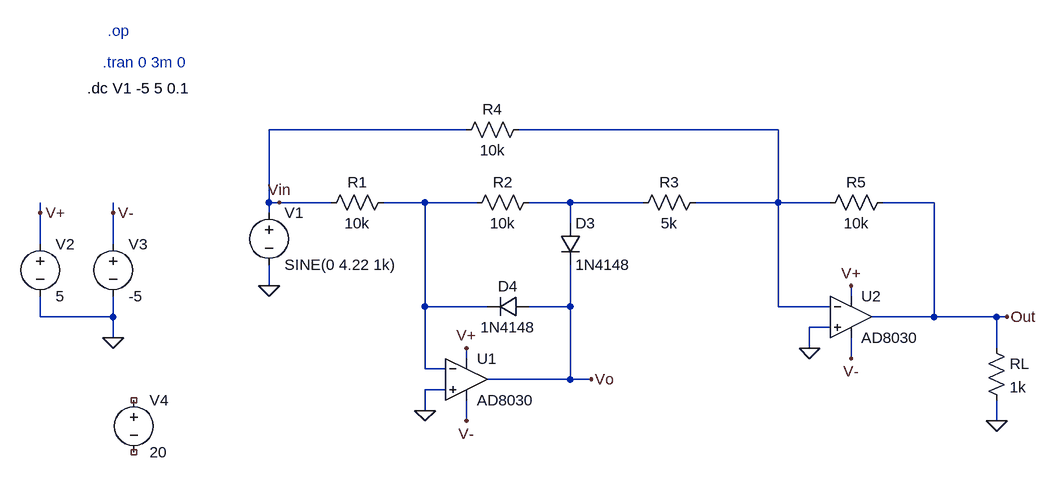
[diagram p0: schematic Stage4.asc]
Stage4.asc, the LTspice schematic file:
Version 4
SHEET 1 956 680
WIRE 0 -416 -304 -416
WIRE 480 -416 80 -416
WIRE -304 -304 -304 -416
WIRE -288 -304 -304 -304
WIRE -208 -304 -288 -304
WIRE -64 -304 -128 -304
WIRE 16 -304 -64 -304
WIRE 160 -304 96 -304
WIRE 272 -304 160 -304
WIRE 480 -304 480 -416
WIRE 480 -304 352 -304
WIRE 560 -304 480 -304
WIRE 720 -304 640 -304
WIRE -656 -288 -656 -304
WIRE -544 -288 -544 -304
WIRE -304 -288 -304 -304
WIRE 160 -272 160 -304
WIRE -656 -240 -656 -288
WIRE -544 -240 -544 -288
WIRE -304 -176 -304 -208
WIRE 592 -160 592 -176
WIRE -64 -144 -64 -304
WIRE 32 -144 -64 -144
WIRE 160 -144 160 -208
WIRE 160 -144 96 -144
WIRE 480 -144 480 -304
WIRE 560 -144 480 -144
WIRE -656 -128 -656 -160
WIRE -544 -128 -544 -160
WIRE -544 -128 -656 -128
WIRE 720 -128 720 -304
WIRE 720 -128 624 -128
WIRE 816 -128 720 -128
WIRE 832 -128 816 -128
WIRE 560 -112 528 -112
WIRE -544 -96 -544 -128
WIRE 528 -80 528 -112
WIRE 816 -80 816 -128
WIRE 0 -64 0 -80
WIRE 592 -64 592 -96
WIRE -64 -48 -64 -144
WIRE -32 -48 -64 -48
WIRE 160 -32 160 -144
WIRE 160 -32 32 -32
WIRE 192 -32 160 -32
WIRE -32 -16 -64 -16
WIRE -64 16 -64 -16
WIRE 0 32 0 0
WIRE 816 32 816 0
FLAG -304 -176 0
FLAG 832 -128 Out
FLAG -544 -96 0
FLAG -656 -288 V+
FLAG -544 -288 V-
FLAG 592 -176 V+
FLAG 592 -64 V-
FLAG 816 32 0
FLAG -64 16 0
FLAG 192 -32 Vo
FLAG 0 -80 V+
FLAG 0 32 V-
FLAG 528 -80 0
FLAG -288 -304 Vin
DATAFLAG 176 -32 ""
SYMBOL voltage -304 -304 R0
WINDOW 123 0 0 Left 2
WINDOW 39 0 0 Left 2
SYMATTR InstName V1
SYMATTR Value SINE(0 4.22 1k)
SYMBOL voltage -656 -256 R0
WINDOW 123 0 0 Left 2
WINDOW 39 0 0 Left 2
SYMATTR InstName V2
SYMATTR Value 5
SYMBOL voltage -544 -256 R0
WINDOW 123 0 0 Left 2
WINDOW 39 0 0 Left 2
SYMATTR InstName V3
SYMATTR Value -5
SYMBOL res 800 -96 R0
SYMATTR InstName RL
SYMATTR Value 1k
SYMBOL res -112 -320 R90
WINDOW 0 0 56 VBottom 2
WINDOW 3 32 56 VTop 2
SYMATTR InstName R1
SYMATTR Value 10k
SYMBOL res 96 -432 R90
WINDOW 0 0 56 VBottom 2
WINDOW 3 32 56 VTop 2
SYMATTR InstName R4
SYMATTR Value 10k
SYMBOL res 368 -320 R90
WINDOW 0 0 56 VBottom 2
WINDOW 3 32 56 VTop 2
SYMATTR InstName R3
SYMATTR Value 5k
SYMBOL res 656 -320 R90
WINDOW 0 0 56 VBottom 2
WINDOW 3 32 56 VTop 2
SYMATTR InstName R5
SYMATTR Value 10k
SYMBOL res 112 -320 R90
WINDOW 0 0 56 VBottom 2
WINDOW 3 32 56 VTop 2
SYMATTR InstName R2
SYMATTR Value 10k
SYMBOL diode 144 -272 R0
SYMATTR InstName D3
SYMATTR Value 1N4148
SYMBOL diode 96 -160 R90
WINDOW 0 0 32 VBottom 2
WINDOW 3 32 32 VTop 2
SYMATTR InstName D4
SYMATTR Value 1N4148
SYMBOL OpAmps\\AD8030 0 -96 R0
SYMATTR InstName U1
SYMBOL OpAmps\\AD8030 592 -192 R0
SYMATTR InstName U2
SYMBOL voltage -512 -16 R0
SYMATTR InstName V4
SYMATTR Value 20
TEXT -560 -520 Left 2 ;.tran 0 3m 0
TEXT -584 -480 Left 2 !.dc V1 -5 5 0.1
TEXT -552 -568 Left 2 ;.op

The netlist it stands for:
* Stage4.asc
V1 Vin 0 SINE(0 4.22 1k)
V2 V+ 0 5
V3 V- 0 -5
RL Out 0 1k
R1 N002 Vin 10k
R4 N001 Vin 10k
R3 N001 N003 5k
R5 Out N001 10k
R2 N003 N002 10k
D3 N003 Vo 1N4148
D4 Vo N002 1N4148
XU1 0 N002 V+ V- Vo AD8040  ; AD8030, pins In+ In- V+ V- OUT
XU2 0 N001 V+ V- Out AD8040  ; AD8030, pins In+ In- V+ V- OUT
V4 NC_01 NC_02 20
.model D D
.lib standard.dio
* .tran 0 3m 0
.dc V1 -5 5 0.1
* .op
.lib ADI.lib
.backanno
.end